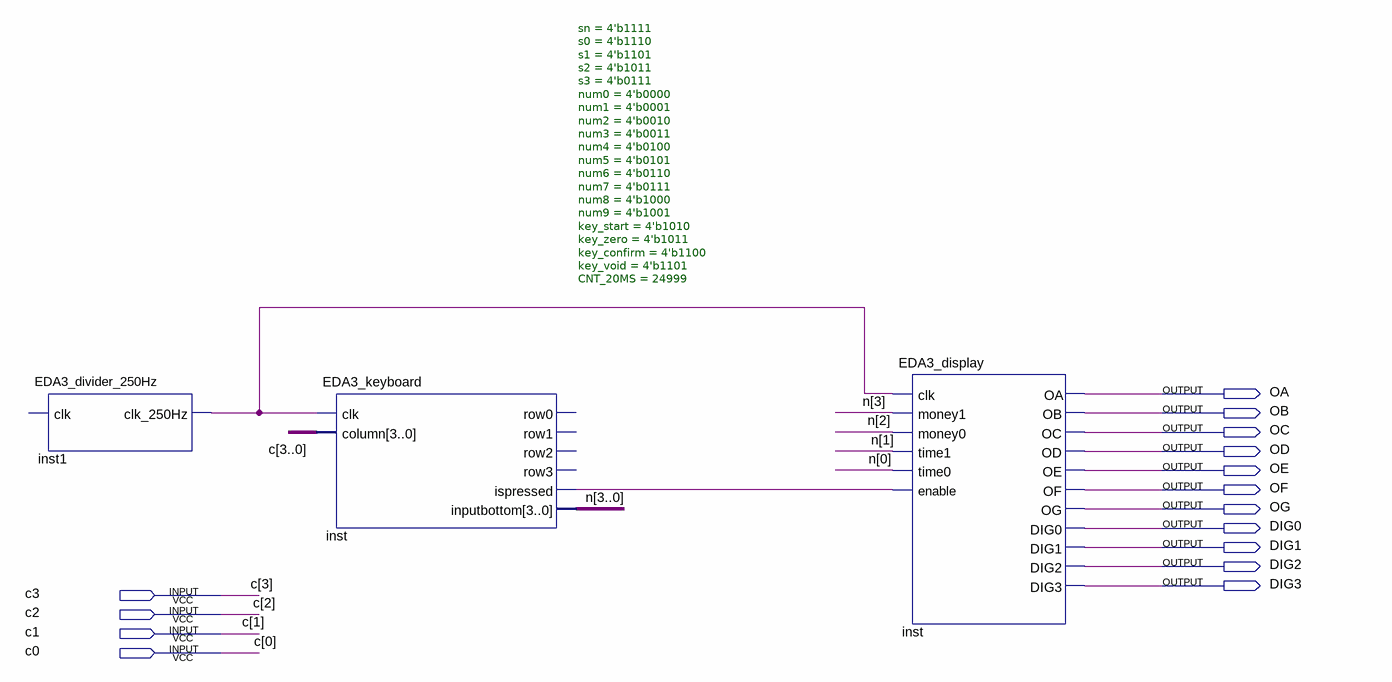
[diagram p0: schematic sheet]
// Quartus schematic EDA3_week13test.bdf as structural Verilog: 3 symbols, 15 pins
module EDA3_week13test (
  input  c3,
  input  c2,
  input  c1,
  input  c0,
  output OA,
  output OB,
  output OC,
  output OD,
  output OE,
  output OF,
  output OG,
  output DIG0,
  output DIG1,
  output DIG2,
  output DIG3
);

  wire inst1_clk_250hz, inst_ispressed;
  wire [3:0] n;

  EDA3_divider_250Hz inst1 (.clk_250Hz(inst1_clk_250hz));  // open: clk
  EDA3_keyboard #(.sn(4'b1111), .s0(4'b1110), .s1(4'b1101), .s2(4'b1011), .s3(4'b0111), .num0(4'b0000), .num1(4'b0001), .num2(4'b0010), .num3(4'b0011), .num4(4'b0100), .num5(4'b0101), .num6(4'b0110), .num7(4'b0111), .num8(4'b1000), .num9(4'b1001), .key_start(4'b1010), .key_zero(4'b1011), .key_confirm(4'b1100), .key_void(4'b1101), .CNT_20MS(24999)) inst (
    .clk(inst1_clk_250hz), .column({c3, c2, c1, c0}), .ispressed(inst_ispressed), .inputbottom(n));  // open: row0, row1, row2, row3
  EDA3_display inst_dup2 (
    .clk(inst1_clk_250hz), .money1(n[3]), .money0(n[2]), .time1(n[1]), .time0(n[0]), .enable(inst_ispressed),
    .OA(OA), .OB(OB), .OC(OC), .OD(OD), .OE(OE), .OF(OF), .OG(OG), .DIG0(DIG0), .DIG1(DIG1), .DIG2(DIG2),
    .DIG3(DIG3));
endmodule
